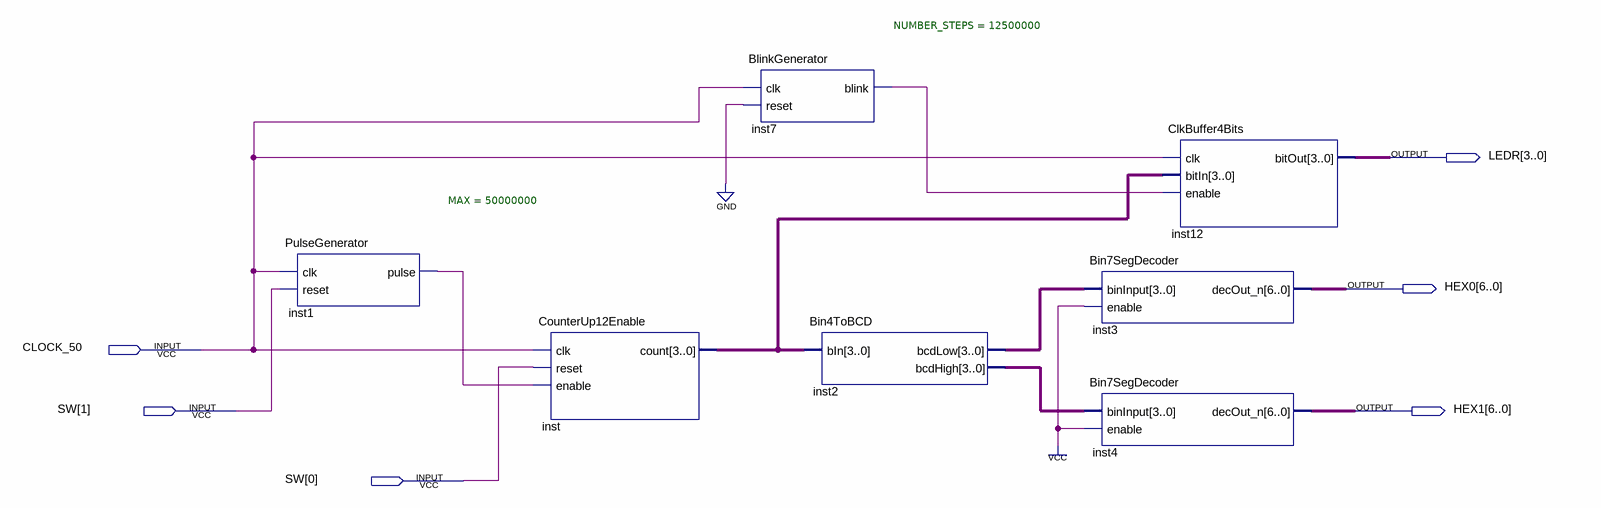
[diagram p0: schematic sheet]
// Quartus schematic projetoTreino.bdf as structural Verilog: 7 symbols, 6 pins
module projetoTreino (
  input  CLOCK_50,
  input  [1:0] SW,
  output [3:0] LEDR,
  output [6:0] HEX0,
  output [6:0] HEX1
);

  wire inst1_pulse, inst7_blink;
  wire [3:0] inst2_bcdhigh, inst2_bcdlow, inst_count;

  PulseGenerator #(.MAX(50000000)) inst1 (.clk(CLOCK_50), .reset(SW[1]), .pulse(inst1_pulse));
  CounterUp12Enable inst (.clk(CLOCK_50), .reset(SW[0]), .enable(inst1_pulse), .count(inst_count));
  BlinkGenerator #(.NUMBER_STEPS(12500000)) inst7 (.clk(CLOCK_50), .reset(1'b0), .blink(inst7_blink));
  Bin4ToBCD inst2 (.bIn(inst_count), .bcdLow(inst2_bcdlow), .bcdHigh(inst2_bcdhigh));
  Bin7SegDecoder inst3 (.binInput(inst2_bcdlow), .enable(1'b1), .decOut_n(HEX0));
  Bin7SegDecoder inst4 (.binInput(inst2_bcdhigh), .enable(1'b1), .decOut_n(HEX1));
  ClkBuffer4Bits inst12 (.clk(CLOCK_50), .bitIn(inst_count), .enable(inst7_blink), .bitOut(LEDR));
endmodule
